# EAGLE design pich (EAGLE 6.5.0)
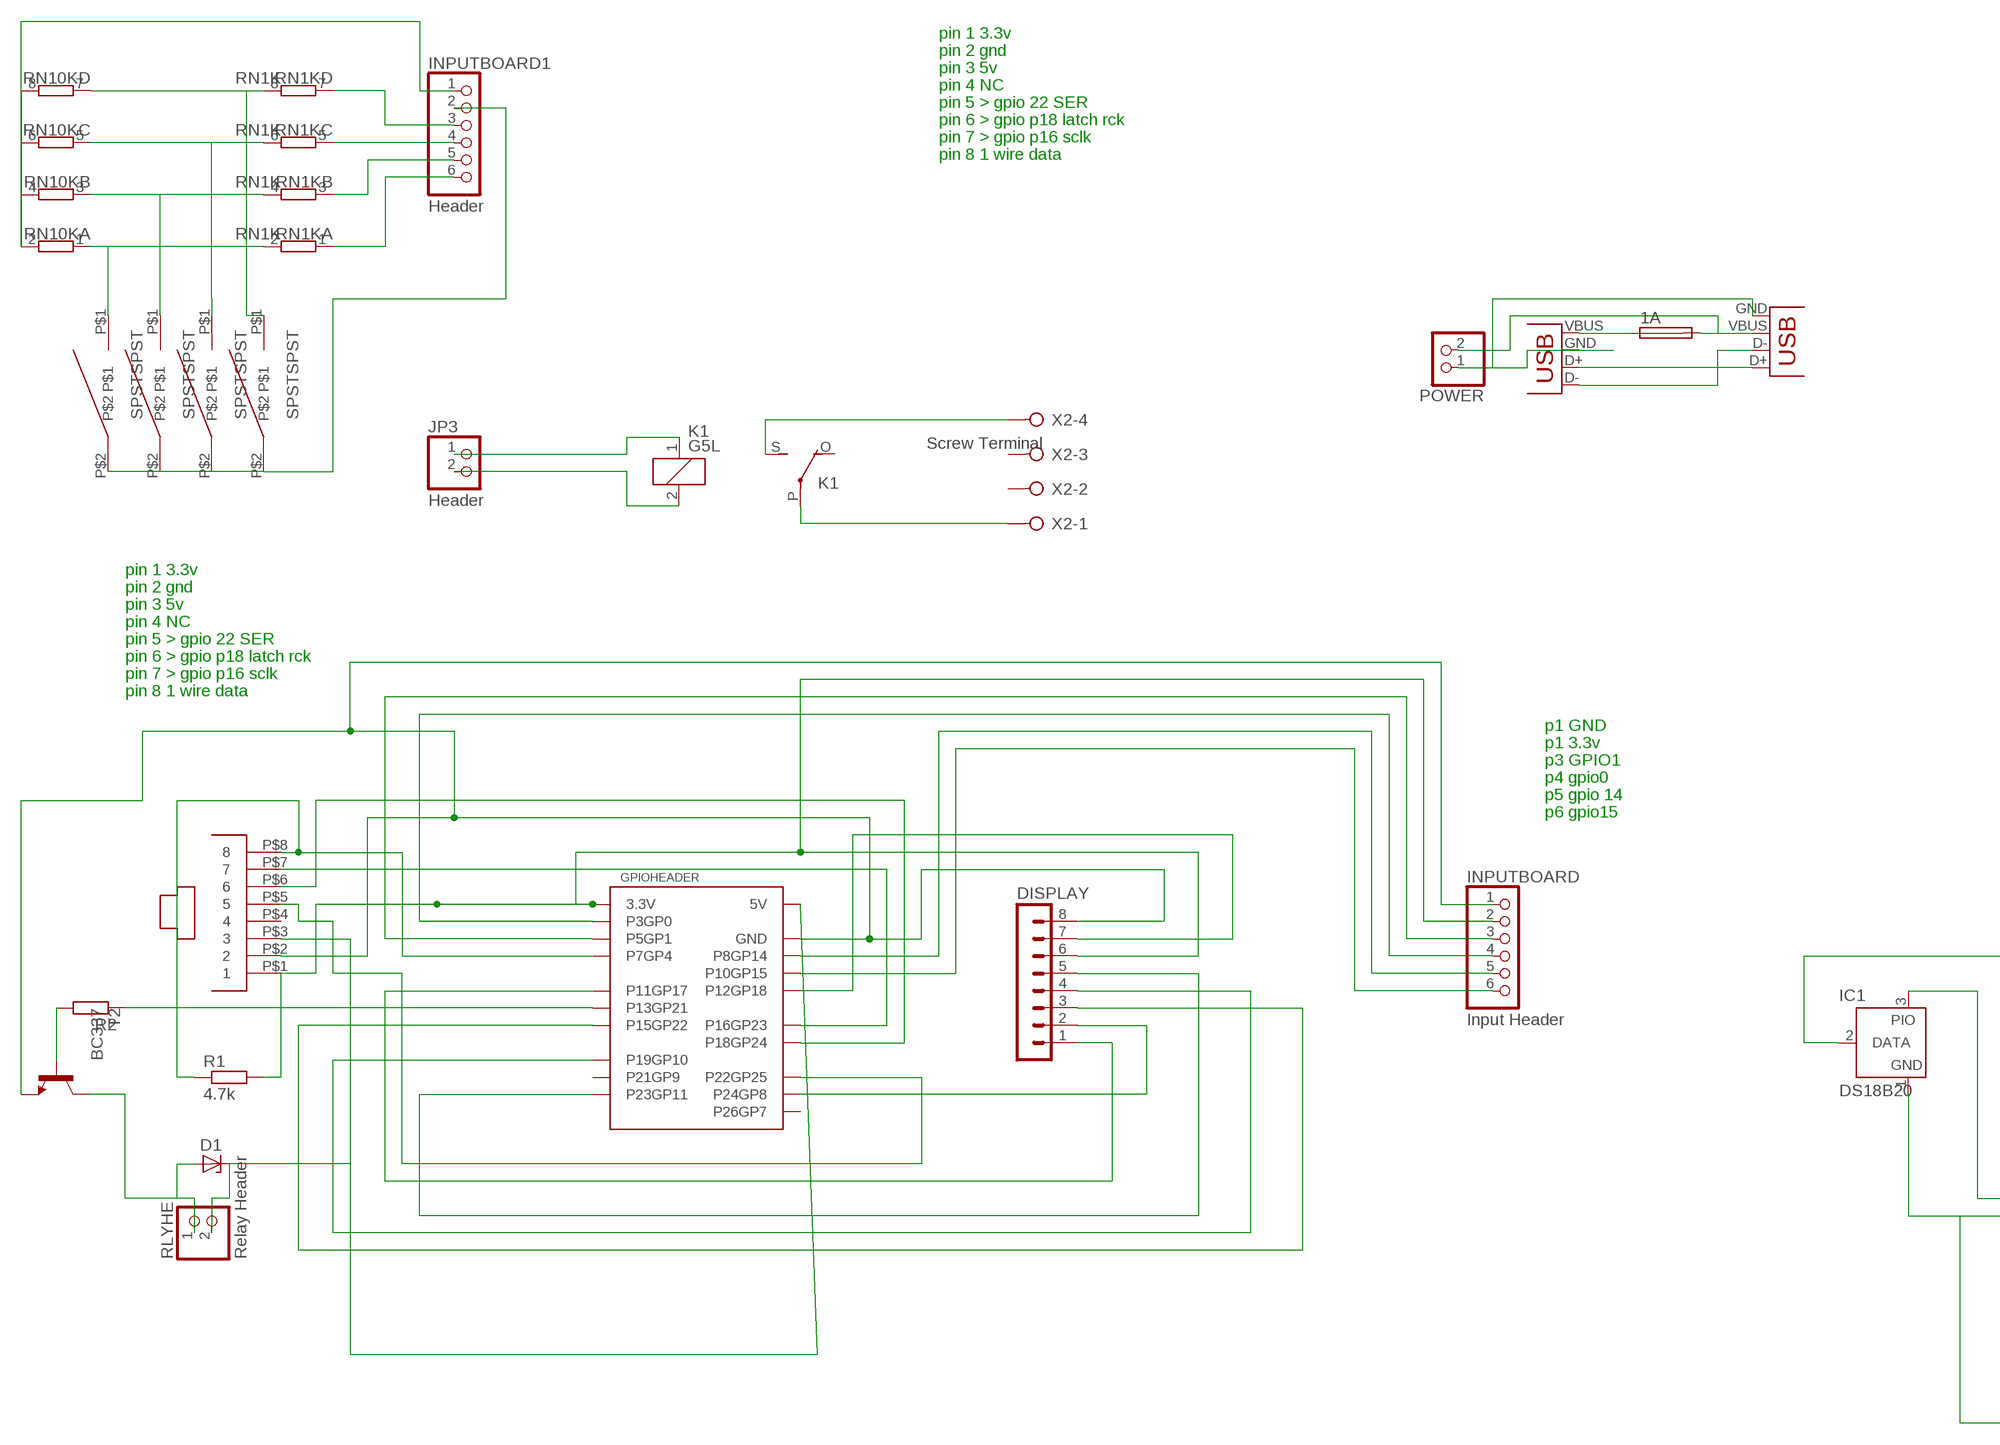
[diagram p0: schematic, sheet 1, part 1 of 2]
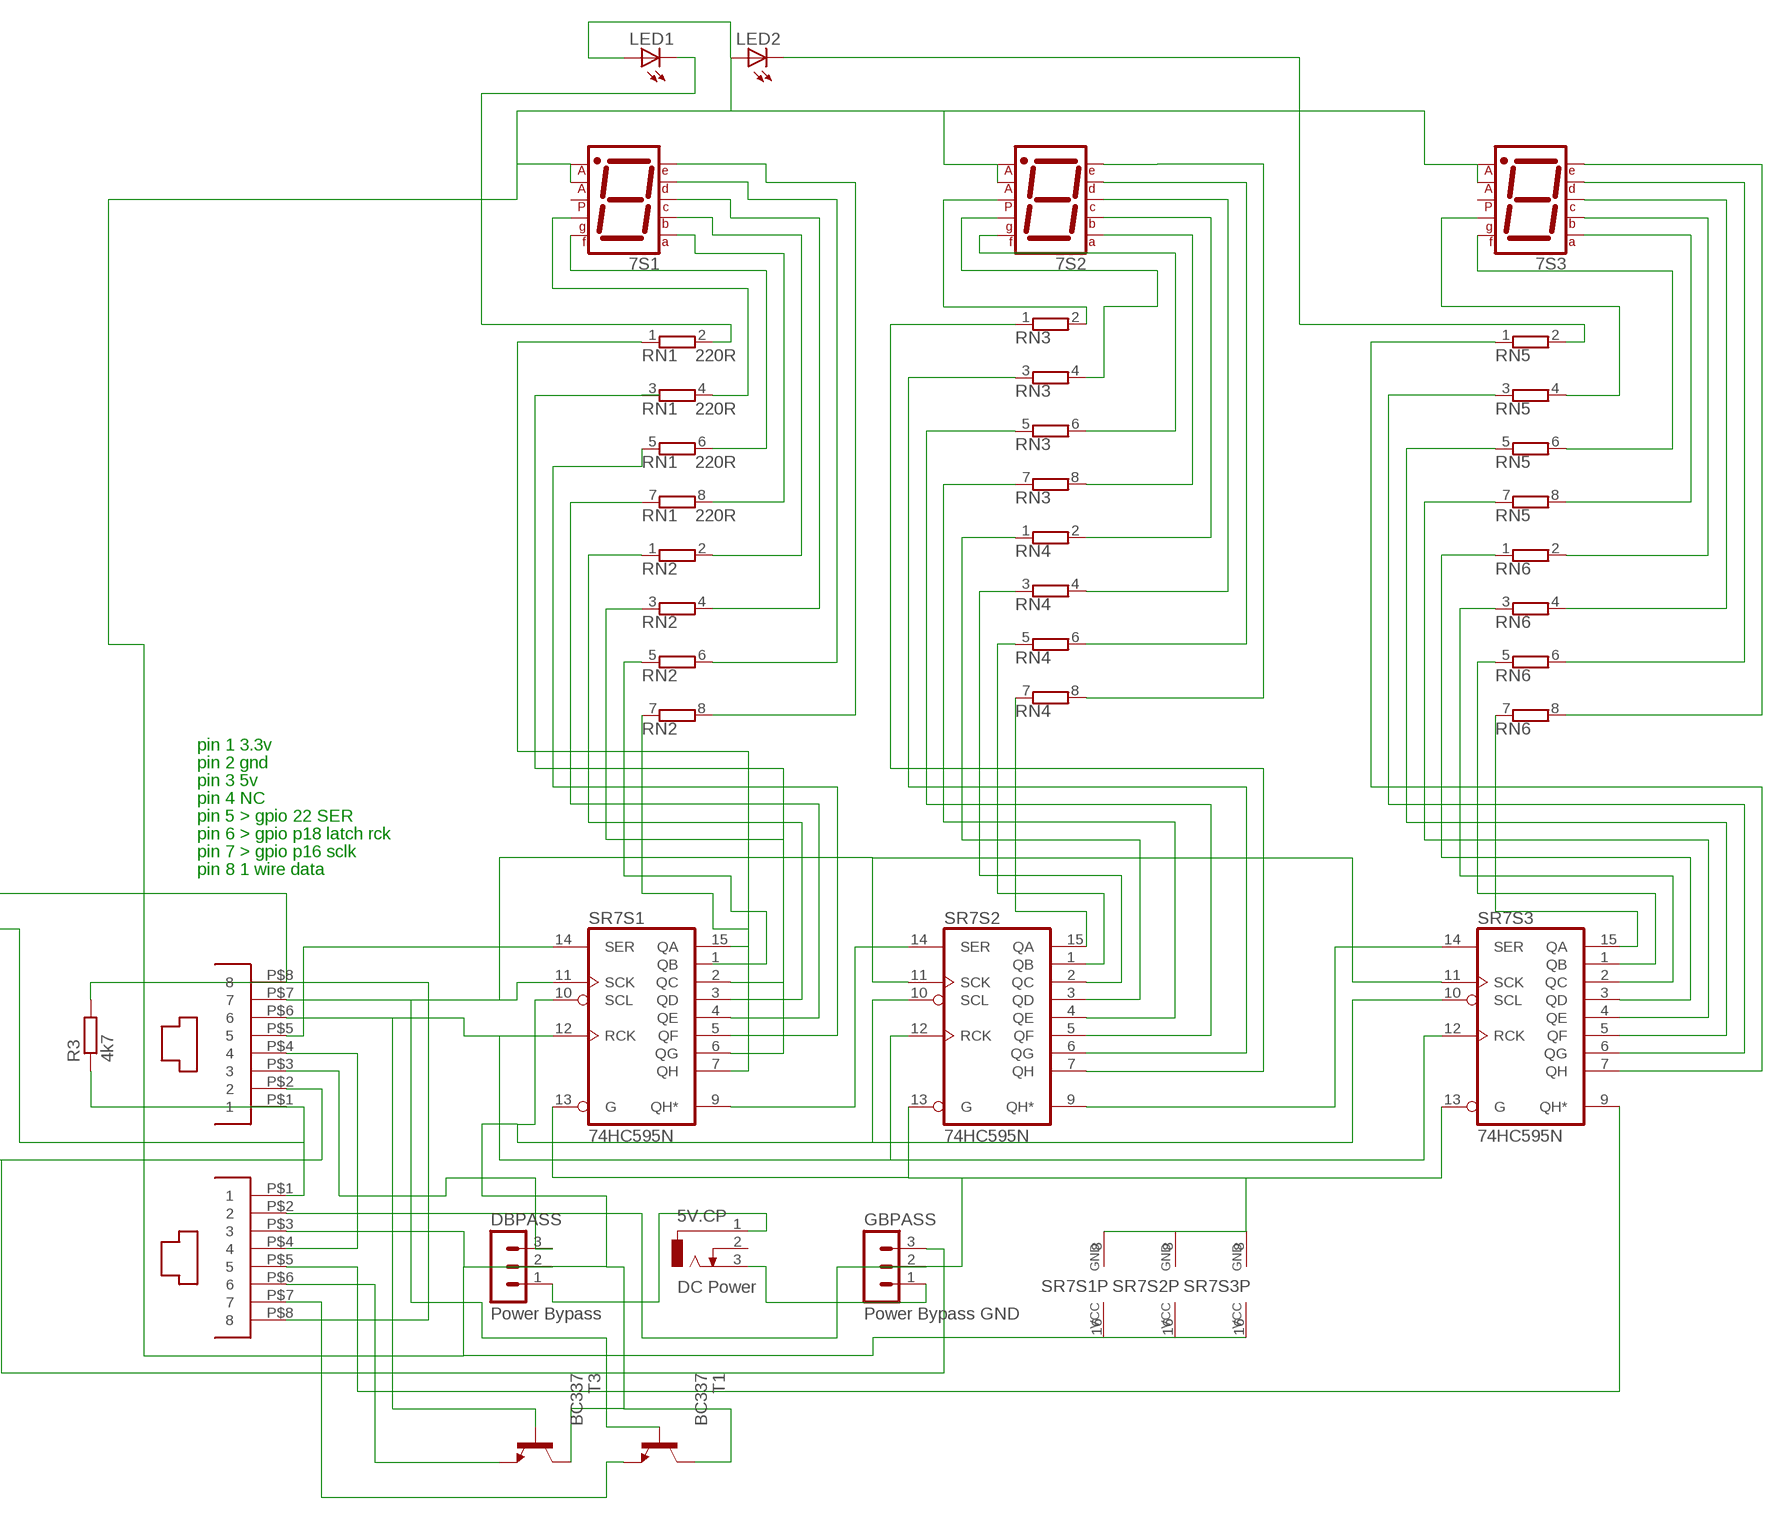
[diagram p1: schematic, sheet 1, part 2 of 2]

## Parts
1A  QPL  [QPL]
5V.CP  DC Power  DCJ0303  [DCJ0303]
7S1  7SEG-MCA  [7SEG-7]
7S2  7SEG-MCA  [7SEG-7]
7S3  7SEG-MCA  [7SEG-7]
.  USB-A-H  [USB-A-H]
D1  1N821  [DO35Z10]
DBPASS  Power Bypass  MA03-1  [MA03-1]
DISPLAY  MA08-1  [MA08-1]
GBPASS  Power Bypass GND  MA03-1  [MA03-1]
GPIOHEADER  GPIOGPIOHEADER  [FE13-2]
IC1  DS18B20  DS2405  [TO92-]
INPUTBOARD  Input Header  PINHD-1X6  [1X06]
INPUTBOARD1  Header  PINHD-1X6  [1X06]
INPUTHEADER  ETHERNETTRUCONNECTRAPID  [ETHERNET]
JP3  Header  PINHD-1X2  [1X02]
K1  G5L  [G5LE]
LED1  LED3MM  [LED3MM]
LED2  LED3MM  [LED3MM]
OUTPUTHEADER  ETHERNETTRUCONNECTRAPID  [ETHERNET]
POWER  PINHD-1X2  [1X02]
R1  4.7k  R-EU_0207/10  [0207/10]
R2  R-EU_0204/7  [0204/7]
R3  4k7  R-EU_0204/2V  [0204V]
RLYHE  Relay Header  PINHD-1X2  [1X02]
RN1  220R  E4RP  [SIL8]
RN1K  RN1K  E4R  [SIL8]
RN2  E4RP  [SIL8]
RN3  E4RP  [SIL8]
RN4  E4RP  [SIL8]
RN5  E4RP  [SIL8]
RN6  E4RP  [SIL8]
RN10K  E4R  [SIL8]
SR7S1  74HC595N  [DIL16]
SR7S2  74HC595N  [DIL16]
SR7S3  74HC595N  [DIL16]
T1  BC337  [TO92]
T2  BC337  [TO92]
T3  BC337  [TO92]
THERMHEADER  ETHERNETTRUCONNECTRAPID  [ETHERNET]
U$2  SPSTSPST  [MAPLINSWITCH]
U$3  SPSTSPST  [MAPLINSWITCH]
U$4  SPSTSPST  [MAPLINSWITCH]
U$5  SPSTSPST  [MAPLINSWITCH]
X1  USB-A-HU  [USB-A-HU]
X2  Screw Terminal  W237-04P  [W237-4P]

## Nets
GND: DISPLAY.8 GPIOHEADER.6(GND) GPIOHEADER.9(GND) GPIOHEADER.14(GND) GPIOHEADER.20(GND) GPIOHEADER.25(GND) INPUTBOARD.1 T2.1(E) THERMHEADER.P$2
GND1: ..GND(VBUS) POWER.1 X1.GND
GPIO4W1DATA: GPIOHEADER.7(P7GP4) R1.1 THERMHEADER.P$8
N$1: 1A.2 POWER.2 X1.VBUS
N$2: D1.C GPIOHEADER.2(5V) GPIOHEADER.4(5V) RLYHE.2 THERMHEADER.P$3
N$3: DISPLAY.7 GPIOHEADER.12(P12GP18)
N$4: DISPLAY.1 GPIOHEADER.11(P11GP17)
N$5: DISPLAY.5 GPIOHEADER.23(P23GP11)
N$6: DISPLAY.4 GPIOHEADER.19(P19GP10)
N$7: DISPLAY.3 GPIOHEADER.15(P15GP22)
N$8: DISPLAY.2 GPIOHEADER.24(P24GP8)
N$9: GPIOHEADER.16(P16GP23) THERMHEADER.P$7
N$10: GPIOHEADER.18(P18GP24) THERMHEADER.P$6
N$11: GPIOHEADER.22(P22GP25) THERMHEADER.P$5
N$12: D1.A RLYHE.1 T2.3(C)
N$13: GPIOHEADER.13(P13GP21) R2.1
N$14: R2.2 T2.2(B)
N$15: JP3.1 K1.1
N$16: JP3.2 K1.2
N$17: GPIOHEADER.3(P3GP0) INPUTBOARD.4
N$18: GPIOHEADER.8(P8GP14) INPUTBOARD.5
N$19: GPIOHEADER.5(P5GP1) INPUTBOARD.3
N$20: GPIOHEADER.10(P10GP15) INPUTBOARD.6
N$21: K1.P(2:P) X2.1
N$22: K1.S(2:S) X2.4
N$23: SR7S1.9(QH*) SR7S2.14(SER)
N$24: IC1.3(PIO) INPUTHEADER.P$1 OUTPUTHEADER.P$1 R3.1
N$25: GBPASS.2 OUTPUTHEADER.P$2 SR7S1.8(GND) SR7S1.13(G) SR7S2.8(GND) SR7S2.13(G) SR7S3.8(GND) SR7S3.13(G)
N$26: INPUTHEADER.P$4 OUTPUTHEADER.P$4
N$27: INPUTHEADER.P$5 SR7S1.14(SER)
N$28: INPUTHEADER.P$6 SR7S1.12(RCK) SR7S2.12(RCK) SR7S3.12(RCK) T3.2(B)
N$30: IC1.2(DATA) INPUTHEADER.P$8 OUTPUTHEADER.P$8 R3.2
N$31: SR7S2.9(QH*) SR7S3.14(SER)
N$32: LED1.K(C) RN1.2
N$33: 7S1.3(G) RN1.4
N$34: 7S1.2(F) RN1.6
N$35: 7S1.10(A) RN1.8
N$36: 7S1.9(B) RN2.2
N$37: 7S1.8(C) RN2.4
N$38: 7S1.5(D) RN2.6
N$39: 7S1.4(E) RN2.8
N$40: RN2.7 SR7S1.15(QA)
N$41: RN2.5 SR7S1.1(QB)
N$42: RN2.3 SR7S1.2(QC)
N$43: RN2.1 SR7S1.3(QD)
N$44: RN1.7 SR7S1.4(QE)
N$45: RN1.5 SR7S1.5(QF)
N$46: RN1.3 SR7S1.6(QG)
N$47: RN1.1 SR7S1.7(QH)
N$48: GBPASS.3 IC1.1(GND) INPUTHEADER.P$2
N$49: 7S2.7(DP) RN3.2
N$50: 7S2.3(G) RN3.4
N$51: 7S2.2(F) RN3.6
N$52: 7S2.10(A) RN3.8
N$53: 7S2.9(B) RN4.2
N$54: 7S2.8(C) RN4.4
N$55: 7S2.5(D) RN4.6
N$56: 7S2.4(E) RN4.8
N$57: RN4.7 SR7S2.15(QA)
N$58: RN4.5 SR7S2.1(QB)
N$59: RN4.1 SR7S2.3(QD)
N$60: RN3.7 SR7S2.4(QE)
N$61: RN3.3 SR7S2.6(QG)
N$62: RN3.1 SR7S2.7(QH)
N$63: LED2.K(C) RN5.2
N$64: 7S3.3(G) RN5.4
N$65: 7S3.2(F) RN5.6
N$66: 7S3.10(A) RN5.8
N$67: 7S3.9(B) RN6.2
N$68: 7S3.8(C) RN6.4
N$69: 7S3.5(D) RN6.6
N$70: 7S3.4(E) RN6.8
N$71: RN6.7 SR7S3.15(QA)
N$72: RN6.5 SR7S3.1(QB)
N$73: RN6.3 SR7S3.2(QC)
N$74: RN6.1 SR7S3.3(QD)
N$75: RN5.7 SR7S3.4(QE)
N$76: RN5.5 SR7S3.5(QF)
N$77: RN5.3 SR7S3.6(QG)
N$78: RN5.1 SR7S3.7(QH)
N$79: DBPASS.3 INPUTHEADER.P$3
N$80: RN4.3 SR7S2.2(QC)
N$81: RN3.5 SR7S2.5(QF)
N$82: 5V.CP.1 DBPASS.1
N$83: 5V.CP.3 GBPASS.1
N$84: 7S1.1(CA1) 7S1.6(CA2) 7S2.1(CA1) 7S2.6(CA2) 7S3.1(CA1) 7S3.6(CA2) DBPASS.2 LED1.A LED2.A OUTPUTHEADER.P$3 SR7S1.10(SCL) SR7S1.16(VCC) SR7S2.10(SCL) SR7S2.16(VCC) SR7S3.10(SCL) SR7S3.16(VCC) T1.3(C) T3.3(C)
N$85: OUTPUTHEADER.P$5 SR7S3.9(QH*)
N$86: 1A.1 ..VBUS(GND)
N$87: ..D-(D+) X1.D-
N$88: ..D+(D-) X1.D+
N$93: OUTPUTHEADER.P$7 T1.1(E)
N$94: RN1K.8 RN10K.7 U$5.P$1
N$95: INPUTBOARD1.1 RN10K.2 RN10K.4 RN10K.6 RN10K.8
N$96: INPUTBOARD1.3 RN1K.7
N$97: INPUTBOARD1.4 RN1K.5
N$98: INPUTBOARD1.5 RN1K.3
N$99: INPUTBOARD1.6 RN1K.1
N$100: INPUTBOARD1.2 U$2.P$2 U$3.P$2 U$4.P$2 U$5.P$2
N$101: RN1K.6 RN10K.5 U$4.P$1
N$102: RN1K.4 RN10K.3 U$3.P$1
N$103: RN1K.2 RN10K.1 U$2.P$1
N$104: INPUTHEADER.P$7 SR7S1.11(SCK) SR7S2.11(SCK) SR7S3.11(SCK) T1.2(B)
N$107: OUTPUTHEADER.P$6 T3.1(E)
VCC: DISPLAY.6 GPIOHEADER.1(3.3V) GPIOHEADER.17(3.3V) INPUTBOARD.2 R1.2 THERMHEADER.P$1
Unconnected: 5V.CP.2 7S1.7(DP) 7S3.7(DP) GPIOHEADER.21(P21GP9) GPIOHEADER.26(P26GP7) K1.O(2:O) THERMHEADER.P$4 X2.2 X2.3

## Notes on the sheet
- pin 1 3.3v
- pin 2 gnd
- pin 3 5v
- pin 4 NC
- pin 5 > gpio 22 SER
- pin 6 > gpio p18 latch rck
- pin 7 > gpio p16 sclk
- pin 8 1 wire data
- pin 1 3.3v
- pin 2 gnd
- pin 3 5v
- pin 4 NC
- pin 5 > gpio 22 SER
- pin 6 > gpio p18 latch rck
- pin 7 > gpio p16 sclk
- pin 8 1 wire data
- p1 GND
- p1 3.3v
- p3 GPIO1
- p4 gpio0
- p5 gpio 14
- p6 gpio15 | pin 1 3.3v
- pin 2 gnd
- pin 3 5v
- pin 4 NC
- pin 5 > gpio 22 SER
- pin 6 > gpio p18 latch rck
- pin 7 > gpio p16 sclk
- pin 8 1 wire data

## Library data of the parts
1A = fuse:QPL: Fuseholder for Micro(TM) Fuse or Pico(R) II Fuses 281 005, 281 008 Source:www.littlefuse.com .. 281005A.PDF; OC_FARNELL: 1608231; OC_NEWARK: unknown
5V.CP = con-jack:DCJ0303: DC POWER JACK Source: DCJ0303.pdf; OC_FARNELL: unknown; OC_NEWARK: unknown
7S1-7S3 = special:7SEG-MCA: 7-segment DISPLAY single anode, 13 mm
. = SparkFun-Connectors:USB: USB Connectors USB-B-PTH is fully proven SKU : PRT-00139/CONN-08278 USB-miniB is fully proven SKU : PRT-00587 USB-A-PCB is untested. USB-A-H is throughly reviewed, but untested. Spark Fun Electronics SKU : PRT-00437 USB-B-SMT is throughly reviewed, but untested. Needs silkscreen touching up. USB-A-S has not been used/tested USB-MB-H has not been used/tested USB-MICROB has been used. CONN-09505
D1 = diode:1N821: Reference DIODE temperature compensated, 6,2 V
DBPASS GBPASS = con-lstb:MA03-1: PIN HEADER; OC_FARNELL: unknown; OC_NEWARK: unknown
DISPLAY = con-lstb:MA08-1: PIN HEADER; OC_FARNELL: unknown; OC_NEWARK: unknown
GPIOHEADER = con-lsta:GPIO
IC1 = maxim:DS2405: Addressable Switch DALLAS Semiconductor; MF: DALLAS SEMICONDUCTOR; MPN: DS2405; OC_FARNELL: 1188025; OC_NEWARK: 06F4645
INPUTBOARD INPUTBOARD1 = pinhead:PINHD-1X6: PIN HEADER
INPUTHEADER OUTPUTHEADER THERMHEADER = rpigpio:ETHERNET: http://www.rapidonline.com/pdf/24-0450.pdf http://www.rapidonline.com/Cables-Connectors/8-8-PCB-Socket-24-0465
JP3 POWER RLYHE = pinhead:PINHD-1X2: PIN HEADER
K1 = relay:G5L: RELAY 1 x switch, 10 A/120 V AC, 8 A/30 V ADC, Omron; OC_FARNELL: unknown; OC_NEWARK: unknown
LED1 LED2 = led:LED: LED OSRAM: - CHIPLED LG R971, LG N971, LY N971, LG Q971, LY Q971, LO R971, LY R971 LH N974, LH R974 LS Q976, LO Q976, LY Q976 LO Q996 - Hyper CHIPLED LW Q18S LB Q993, LB Q99A, LB R99A - SideLED LS A670, LO A670, LY A670, LG A670, LP A670 LB A673, LV A673, LT A673, LW A673 LH A674 LY A675 LS A676, LA A676, LO A676, LY A676, LW A676 LS A679, LY A679, LG A679 - Hyper Micro SIDELED® LS Y876, LA Y876, LO Y876, LY Y876 LT Y87S - SmartLED LW L88C, LW L88S LB L89C, LB L89S, LG L890 LS L89K, LO L89K, LY L89K LS L896, LA L896, LO L896, LY L896 - TOPLED LS T670, LO T670, LY T670, LG T670, LP T670 LSG T670, LSP T670, LSY T670, LOP T670, LYG T670 LG T671, LOG T671, LSG T671 LB T673, LV T673, LT T673, LW T673 LH T674 LS T676, LA T676, LO T676, LY T676, LB T676, LH T676, LSB T676, LW T676 LB T67C, LV T67C, LT T67C, LS T67K, LO T67K, LY T67K, LW E67C LS E67B, LA E67B, LO E67B, LY E67B, LB E67C, LV E67C, LT E67C LW T67C LS T679, LY T679, LG T679 LS T770, LO T770, LY T770, LG T770, LP T770 LB T773, LV T773, LT T773, LW T773 LH T774 LS E675, LA E675, LY E675, LS T675 LS T776, LA T776, LO T776, LY T776, LB T776 LHGB T686 LT T68C, LB T68C - Hyper Mini TOPLED® LB M676 - Mini TOPLED Santana® LG M470 LS M47K, LO M47K, LY M47K Source: http://www.osram.convergy.de LUXEON: - LUMILED® LXK2-PW12-R00, LXK2-PW12-S00, LXK2-PW14-U00, LXK2-PW14-V00 LXK2-PM12-R00, LXK2-PM12-S00, LXK2-PM14-U00 LXK2-PE12-Q00, LXK2-PE12-R00, LXK2-PE12-S00, LXK2-PE14-T00, LXK2-PE14-U00 LXK2-PB12-K00, LXK2-PB12-L00, LXK2-PB12-M00, LXK2-PB14-N00, LXK2-PB14-P00, LXK2-PB14-Q00 LXK2-PR12-L00, LXK2-PR12-M00, LXK2-PR14-Q00, LXK2-PR14-R00 LXK2-PD12-Q00, LXK2-PD12-R00, LXK2-PD12-S00 LXK2-PH12-R00, LXK2-PH12-S00 LXK2-PL12-P00, LXK2-PL12-Q00, LXK2-PL12-R00 Source: www.luxeon.com KINGBRIGHT: KA-3528ASYC Source: www.kingbright.com
R1-R3 = resistor:R-EU_: RESISTOR, European symbol
RN1-RN6 = resistor-sil:E4RP: SIL RESISTOR; OC_FARNELL: unknown; OC_NEWARK: unknown
RN1K RN10K = resistor-sil:E4R: SIL RESISTOR; OC_FARNELL: unknown; OC_NEWARK: unknown
SR7S1-SR7S3 = 74xx-eu:74*595: 8-bit SHIFT REGISTER, output latch
T1 T3 = transistor:BC337: NPN TRANSISTOR
T2 = transistor-npn:BC337*: NPN Transistor
U$2-U$5 = rpigpio:SPST
X1 = con-usb:USB: USB Connectors USB-B-PTH is fully proven SKU : PRT-00139/CONN-08278 USB-miniB is fully proven SKU : PRT-00587 USB-A-PCB is untested. USB-A-H is throughly reviewed, but untested. Spark Fun Electronics SKU : PRT-00437 USB-B-SMT is throughly reviewed, but untested. Needs silkscreen touching up. USB-A-S has not been used/tested USB-MB-H has not been used/tested USB-MICROB has been used. CONN-09505
X2 = con-wago-508:W237-04P: WAGO SREW CLAMP; OC_FARNELL: unknown; OC_NEWARK: unknown

## Board
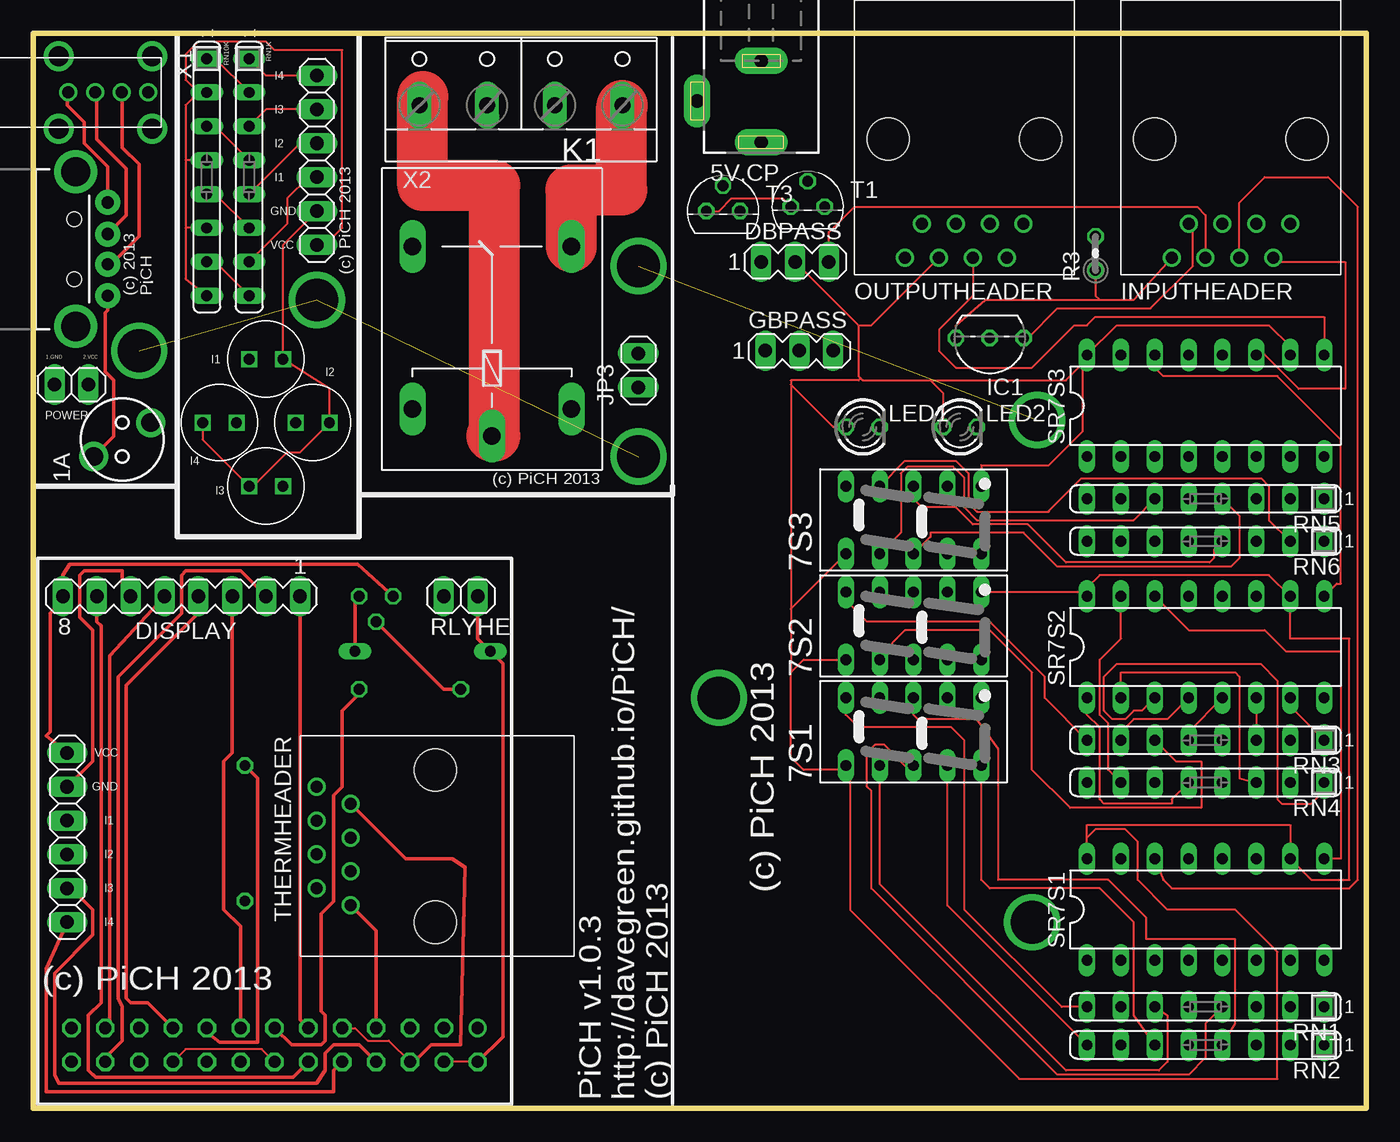
[diagram p2: board, top side]
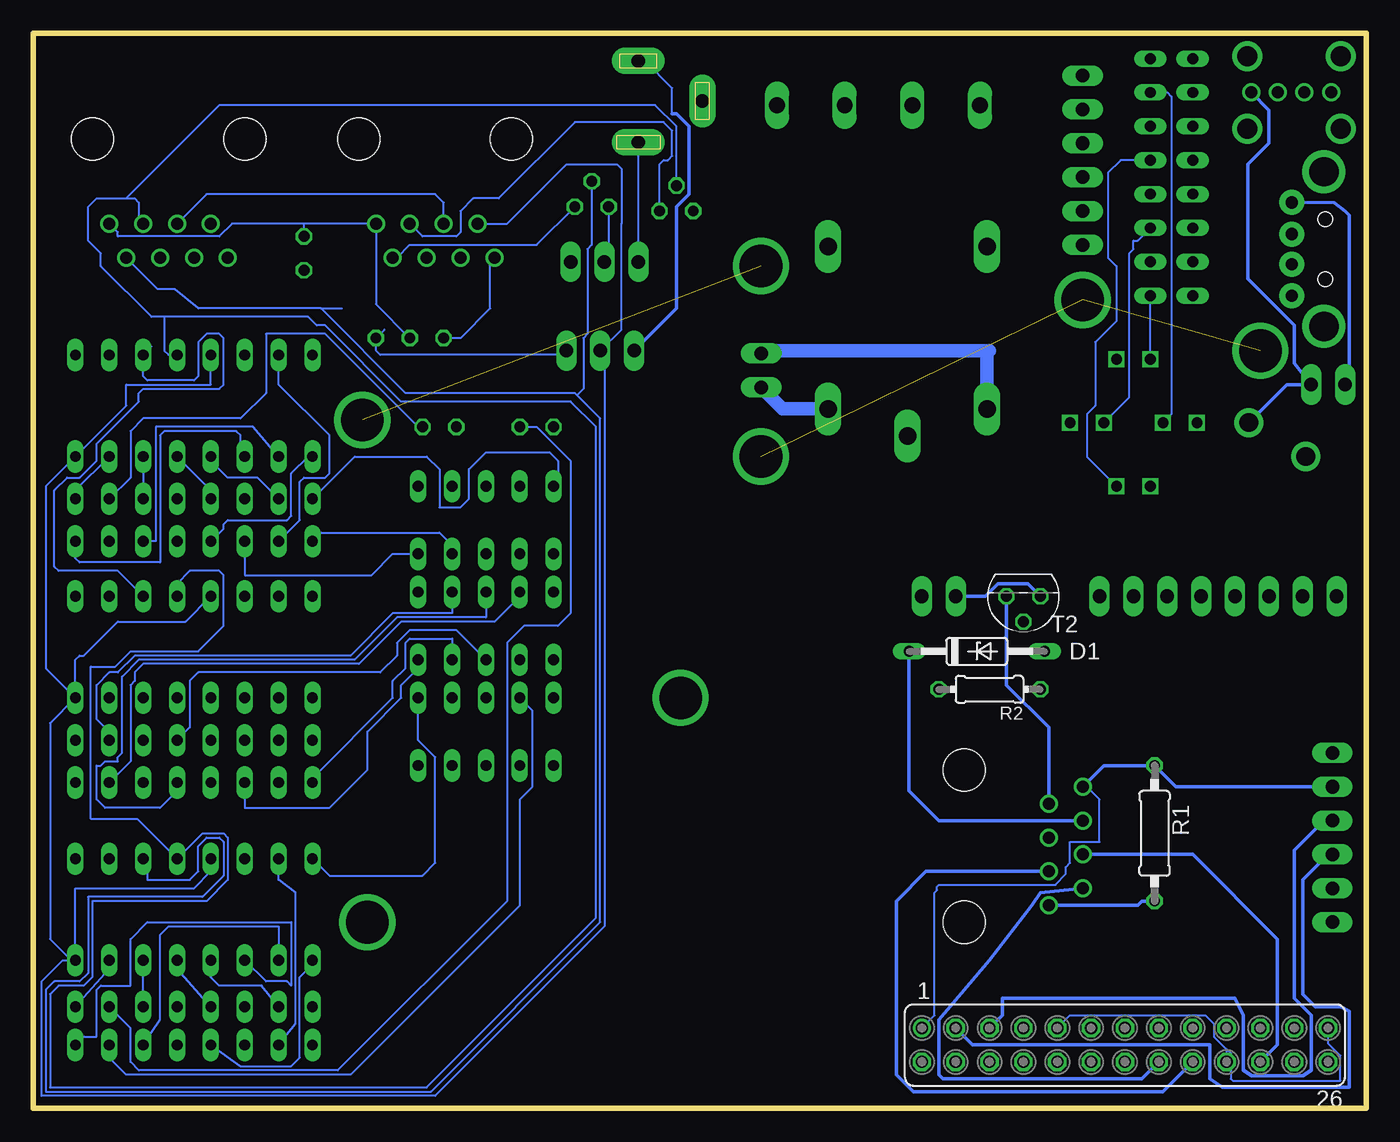
[diagram p3: board, bottom side, seen from below]

Size 100 x 80.64 mm. Coordinates in mm from the lower left corner, seen from the top.
Outline: 0,0 100,0 100,80.64 0,80.64 0,0
Copper layers (1*2*15*16): Top 0.035mm / dielectric 0.2mm / layer 2 0.0175mm / dielectric 1.1mm / layer 15 0.0175mm / dielectric 0.2mm / Bottom 0.035mm
Design rules "default": minimum track width 6mil, minimum drill 12mil, track to track 6mil, track to pad 6mil, pad to pad 6mil, via to via 6mil, smd to smd 0mil, copper to edge 10mil, drill to drill 10mil, minimum pad ring 6mil, minimum via ring 6mil, stop-mask expansion 2mil, vias tented up to drill 25mil, thermal gap 10mil

### Footprints (pad centres in the part's own frame; a part is rotated, then mirrored left to right if it is on the bottom)
QPL = drill 1.4 pad 2.184: 1 -1.27,2.139; 2 1.27,-2.139
DCJ0303 = drill 1 pad 2 long: 1 0,3.1; 2 4.8,0; 3 0,-3
7SEG-7 = drill 0.813 long: 1 -2.54,5.08; 2 -2.54,2.54; 3 -2.54,0; 4 -2.54,-2.54; 5 -2.54,-5.08; 6 2.54,-5.08; 7 2.54,-2.54; 8 2.54,0; 9 2.54,2.54; 10 2.54,5.08
USB-A-H = drill 0.914 pad 1.88: D+ 2.4,1.127; D- 2.4,-1.127; GND 2.4,3.5; VBUS 2.4,-3.5 | drill 2.2: GND2 0,-5.8; GND3 0,5.8 | hole 1.1: -0.1,2.25; -0.1,-2.25
DO35Z10 = drill 0.813 long: A 5.08,0; C -5.08,0
MA03-1 = drill 1.016 long: 1 -2.54,0; 2 0,0; 3 2.54,0
MA08-1 = drill 1.016 long: 1 -8.89,0; 2 -6.35,0; 3 -3.81,0; 4 -1.27,0; 5 1.27,0; 6 3.81,0; 7 6.35,0; 8 8.89,0
FE13-2 = drill 0.914: 1 -15.24,1.27 | drill 0.914 octagon: 2 -15.24,-1.27; 3 -12.7,1.27; 4 -12.7,-1.27; 5 -10.16,1.27; 6 -10.16,-1.27; 7 -7.62,1.27; 8 -7.62,-1.27; 9 -5.08,1.27; 10 -5.08,-1.27; 11 -2.54,1.27; 12 -2.54,-1.27; 13 0,1.27; 14 0,-1.27; 15 2.54,1.27; 16 2.54,-1.27; 17 5.08,1.27; 18 5.08,-1.27; 19 7.62,1.27; 20 7.62,-1.27; 21 10.16,1.27; 22 10.16,-1.27; 23 12.7,1.27; 24 12.7,-1.27; 25 15.24,1.27; 26 15.24,-1.27
TO92- = drill 0.813 octagon: 1 -2.54,0; 2 0,0; 3 2.54,0
1X06 = drill 1.016 long: 1 -6.35,0; 2 -3.81,0; 3 -1.27,0; 4 1.27,0; 5 3.81,0; 6 6.35,0
ETHERNET = drill 0.9: P$1 3.81,1.27; P$2 5.08,3.81; P$3 6.35,1.27; P$4 7.62,3.81; P$5 8.89,1.27; P$6 10.16,3.81; P$7 11.43,1.27; P$8 12.7,3.81 | hole 3.17: 2.54,10.16; 13.97,10.16
1X02 = drill 1.016 long: 1 -1.27,0; 2 1.27,0
G5LE = drill 1.321 long: 1 -7.493,-5.969; 2 -7.493,5.969; O 4.699,5.969; P -9.525,0; S 4.699,-5.969
LED3MM = drill 0.813 octagon: A -1.27,0; K 1.27,0
0207/10 = drill 0.813 octagon: 1 -5.08,0; 2 5.08,0
0204/7 = drill 0.813 octagon: 1 -3.81,0; 2 3.81,0
0204V = drill 0.813 octagon: 1 -1.27,0; 2 1.27,0
SIL8 = drill 0.813 long: 1 -8.89,0; 2 -6.35,0; 3 -3.81,0; 4 -1.27,0; 5 1.27,0; 6 3.81,0; 7 6.35,0; 8 8.89,0
DIL16 = drill 0.813 long: 1 -8.89,-3.81; 2 -6.35,-3.81; 3 -3.81,-3.81; 4 -1.27,-3.81; 5 1.27,-3.81; 6 3.81,-3.81; 7 6.35,-3.81; 8 8.89,-3.81; 9 8.89,3.81; 10 6.35,3.81; 11 3.81,3.81; 12 1.27,3.81; 13 -1.27,3.81; 14 -3.81,3.81; 15 -6.35,3.81; 16 -8.89,3.81
TO92 = drill 0.813 octagon: 1 1.27,0; 2 0,1.905; 3 -1.27,0
MAPLINSWITCH = drill 0.8 square: P$1 -1.27,0; P$2 1.27,0
USB-A-HU = drill 0.9: D+ 2.73,0; D- 4.73,0; GND 0.73,0; VBUS 6.73,0 | drill 1.5: P$5 0,2.72; P$6 0,-2.72; P$7 7,2.72; P$8 7,-2.72
W237-4P = drill 1.194 long: 1 -7.62,-0.635; 2 -2.54,-0.635; 3 2.54,-0.635; 4 7.62,-0.635

### Placement (x,y rotation side)
1A  6.67,50.16 90 top
5V.CP  54.61,75.57 180 top
7S1  66.04,28.26 90 top
7S2  66.04,36.2 90 top
7S3  66.04,44.13 90 top
.  3.17,64.45 0 top
D1  29.21,34.29 0 bottom
DBPASS  57.15,63.5 0 top
DISPLAY  11.11,38.42 180 top
GBPASS  57.47,56.83 0 top
GPIOHEADER  18.1,4.76 0 bottom
IC1  71.75,57.78 180 top
INPUTBOARD  2.54,20.32 270 top
INPUTBOARD1  21.27,71.12 90 top
INPUTHEADER  81.6,62.55 0 top
JP3  45.4,55.36 90 top
K1  34.41,59.96 90 top
LED1  62.23,51.12 0 top
LED2  69.53,51.12 0 top
OUTPUTHEADER  61.59,62.55 0 top
POWER  2.86,54.29 0 top
R1  15.88,20.64 90 bottom
R2  28.26,31.43 180 bottom
R3  79.69,64.14 90 top
RLYHE  32.07,38.42 0 top
RN1  87.95,7.62 180 top
RN1K  16.19,69.85 270 top
RN2  87.95,4.76 180 top
RN3  87.95,27.62 180 top
RN4  87.95,24.45 180 top
RN5  87.95,45.72 180 top
RN6  87.95,42.54 180 top
RN10K  13.02,69.85 270 top
SR7S1  87.95,14.92 0 top
SR7S2  87.95,34.61 0 top
SR7S3  87.95,52.7 0 top
T1  58.1,67.63 0 top
T2  25.72,38.42 180 bottom
T3  51.75,67.31 0 top
THERMHEADER  20,27.94 270 top
U$2  13.97,51.43 180 top
U$3  17.46,46.67 180 top
U$4  20.95,51.43 0 top
U$5  17.46,56.2 0 top
X1  1.91,76.2 0 top
X2  36.59,75.87 0 top

### Tracks (layer width: path | path; a pad name or v marks a point on that pad's centre or on a via)
GND
  Top 0.152: GPIOHEADER.9 24.13,6.03 25.08,5.08 26.67,5.08 GPIOHEADER.6 | GPIOHEADER.14 17.14,4.45 11.43,4.45 GPIOHEADER.20
  Top 0.254: INPUTBOARD.1 0.95,27.94 1.27,28.26 1.27,37.15 2.22,38.1 DISPLAY.8 2.22,40 2.73,40.83 24.32,40.83 T2.1 | GPIOHEADER.6 28.57,3.49 29.84,4.76 32.07,4.76 32.38,18.1 31.43,18.73 27.94,18.73 THERMHEADER.P$2
  Bottom 0.152: GPIOHEADER.9 22.23,6.98 12.06,6.98 11.43,6.35 11.43,5.4 10.48,4.45 | 10.48,4.45 GPIOHEADER.20 | 10.48,4.45 10.16,4.13 10.16,2.22 10.02,2.08 1.94,2.08 1.94,3.96 2.86,4.87 GPIOHEADER.25
  Bottom 0.254: THERMHEADER.P$2 23.81,28.58 26.99,31.75 T2.1
GND1
  Top 0.254: ..GND 5.58,70.62 3.81,72.39 3.81,73.98 2.54,75.25 2.54,76.11 X1.GND
  Bottom 0.254: ..GND 2.39,67.95 1.59,67.31 1.27,66.99 1.27,54.61 POWER.1
GPIO4W1DATA
  Top 0.254: THERMHEADER.P$8 25.72,13.33 GPIOHEADER.7
  Bottom 0.254: R1.1 16.83,15.56 17.14,15.24 THERMHEADER.P$8
N$1
  Bottom 0.254: X1.VBUS 7.3,74.87 7.3,72.39 8.89,70.8 8.89,62.23 5.4,58.74 5.4,55.88 POWER.2 5.95,54.29 1A.2
N$2
  Top 0.152: GPIOHEADER.2 GPIOHEADER.4
  Top 0.254: RLYHE.2 33.34,35.24 D1.C 35.24,33.34 35.24,5.4 GPIOHEADER.2
  Bottom 0.254: D1.C 34.29,23.81 32.07,21.59 THERMHEADER.P$3
N$3
  Top 0.254: DISPLAY.7 4.76,36.51 5.08,36.2 5.08,7.94 4.13,6.98 4.13,2.86 4.45,2.54 4.49,2.54 4.69,2.33 19.48,2.33 GPIOHEADER.12
N$4
  Top 0.254: DISPLAY.1 20,6.67 GPIOHEADER.11
N$5
  Top 0.254: GPIOHEADER.23 5.71,6.03 5.71,33.97 DISPLAY.5
N$6
  Top 0.254: DISPLAY.4 12.38,37.15 6.99,31.75 6.99,8.26 7.3,7.94 8.57,7.94 GPIOHEADER.19
N$7
  Top 0.254: DISPLAY.3 14.92,26.67 14.29,26.04 14.29,14.92 15.56,13.65 GPIOHEADER.15
N$8
  Top 0.254: GPIOHEADER.24 5.4,3.81 6.67,5.08 6.67,7.62 6.35,8.26 6.35,32.38 11.11,37.15 11.11,40 11.43,40.32 15.56,40.32 DISPLAY.2
N$9
  Bottom 0.254: THERMHEADER.P$7 24.45,16.19 25.08,15.24 28.26,11.11 32.07,6.67 32.07,2.54 31.75,2.22 16.83,2.22 GPIOHEADER.16
N$10
  Bottom 0.254: THERMHEADER.P$6 33.02,17.78 35.24,15.56 35.24,2.54 33.97,1.27 15.24,1.27 GPIOHEADER.18
N$11
  Bottom 0.254: THERMHEADER.P$5 13.02,19.05 6.67,12.7 6.67,4.76 GPIOHEADER.22
N$12
  Top 0.254: T2.3 24.13,38.42 D1.A
  Bottom 0.254: RLYHE.1 28.57,38.42 27.62,39.37 25.4,39.37 T2.3
N$13
  Top 0.254: R2.1 24.45,31.12 23.18,29.85 23.18,24.13 22.54,23.5 22.54,15.56 21.59,14.61 21.59,7.3 21.91,6.98 21.91,5.08 21.59,4.76 19.37,4.76 GPIOHEADER.13
N$14
  Top 0.254: R2.2 30.8,31.43 T2.2
N$15
  Bottom 1.016: JP3.1 43.78,52.47 K1.1
N$16
  Bottom 1.016: JP3.2 45.19,56.83 28.26,56.83 28.44,56.65 K1.2
N$17
  Bottom 0.254: INPUTBOARD.4 2.86,19.05 4.76,17.15 4.76,8.57 3.81,7.62 1.91,7.62 1.27,7.3 1.27,1.59 10.79,1.59 11.75,2.22 11.75,4.76 29.53,4.76 GPIOHEADER.3
N$18
  Top 0.254: INPUTBOARD.5 2.86,16.51 4.45,14.92 4.45,13.02 1.59,10.16 1.59,2.54 1.91,1.91 21.27,1.91 21.91,2.86 21.91,4.13 22.54,4.76 24.45,4.76 GPIOHEADER.8
N$19
  Bottom 0.254: INPUTBOARD.3 3.17,21.59 5.4,19.37 5.4,8.26 4.13,6.98 4.13,2.86 4.76,2.47 8.57,2.47 9.21,2.86 9.21,6.98 9.84,8.26 27.3,8.26 27.3,6.98 GPIOHEADER.5
N$20
  Top 0.254: INPUTBOARD.6 0.95,10.48 0.95,1.27 22.54,1.27 22.54,2.86 GPIOHEADER.10
N$21
  Top 0.152: X2.1 28.97,75.64 29.21,75.88
  Top 3.81: K1.P 34.61,50.43 34.61,69.22 29.21,69.22 29.21,75.88
N$22
  Top 3.81: K1.S 40.38,68.84 40.32,68.9 44.13,68.9 44.13,75.16 X2.4
N$23
  Top 0.152: SR7S2.14 86.68,35.88 92.39,35.88 93.98,34.29 98.11,34.29 98.11,18.73 SR7S1.9
N$24
  Top 0.152: IC1.3 69.22,58.74 71.44,60.64 80.01,60.64 | 80.01,60.64 82.55,60.64 INPUTHEADER.P$1 | R3.1 79.69,60.96 80.01,60.64
  Bottom 0.152: IC1.3 67.94,57.78 65.72,60.01 65.72,63.5 OUTPUTHEADER.P$1
N$25
  Bottom 0.152: SR7S2.8 99.06,33.02 99.06,46.67 SR7S3.8 93.03,52.7 93.03,54.29 86.68,54.29 SR7S3.13 | SR7S2.8 98.74,28.89 98.74,12.7 97.16,11.11 SR7S1.8 | SR7S1.8 96.84,16.51 87.95,16.51 86.68,17.78 SR7S1.13 | SR7S1.8 97.79,11.11 99.38,9.53 99.38,0.95 69.85,0.95 57.15,13.65 57.15,56.52 GBPASS.2 55.88,58.42 55.88,64.14 55.88,66.36 55.88,70.48 56.2,70.8 60.01,70.8 64.45,66.36 OUTPUTHEADER.P$2 | SR7S2.8 96.84,33.66 96.52,33.97 96.2,33.97 93.66,36.51 88.58,36.51 SR7S2.13
N$26
  Bottom 0.152: OUTPUTHEADER.P$4 69.22,67.95 69.85,68.58 87,68.58 INPUTHEADER.P$4
N$27
  Top 0.152: 84.45,18.73 SR7S1.14 84.77,17.15 85.41,16.51 98.74,16.51 99.38,17.15 99.38,67.63 97.16,69.85 92.39,69.85 90.49,67.95 INPUTHEADER.P$5
N$28
  Bottom 0.152: 90.17,59.37 90.17,56.83 89.85,56.52 SR7S3.12 | 90.17,59.37 79.38,59.37 78.74,58.74 78.11,58.74 72.39,53.02 59.69,53.02 57.78,51.12 57.78,14.29 70.48,1.59 98.74,1.59 98.74,8.57 98.11,9.21 96.2,9.21 95.57,9.84 95.57,15.56 87,15.56 85.41,17.15 85.41,20.32 85.72,20.64 87.31,20.64 SR7S1.12 92.2,21.71 95.69,21.71 95.69,33.14 93.86,33.14 92.71,34.29 87.63,34.29 85.72,36.2 85.72,40 86.04,40.32 88.27,40.32 89.22,39.37 SR7S2.12 | 90.17,59.37 91.12,59.37 94.93,63.18 94.93,64.14 95.89,65.09 95.89,67.63 95.25,68.26 93.03,68.26 | 93.03,68.26 92.39,68.26 92.08,67.95 92.08,66.68 INPUTHEADER.P$6 | 93.03,68.26 86.04,75.25 63.82,75.25 63.18,75.25 53.34,75.25 51.75,73.66 T3.2
N$30
  Bottom 0.152: 79.69,66.36 OUTPUTHEADER.P$8 74.3,60.32 IC1.2 | 79.69,66.36 85.09,66.36 86.04,65.41 93.66,65.41 93.66,65.72 INPUTHEADER.P$8 | R3.2 79.69,66.36
N$31
  Top 0.152: SR7S2.9 97.79,39.37 98.11,39.37 98.11,50.16 93.34,54.93 84.77,54.93 84.14,55.56 SR7S3.14
N$32
  Bottom 0.152: LED1.K 62.23,51.12 59.69,48.58 59.69,37.15 60.64,36.2 63.18,36.2 64.45,34.92 64.45,15.56 77.15,2.86 92.08,2.86 92.71,3.49 92.71,6.03 RN1.2
N$33
  Top 0.152: RN1.4 87.95,6.35 87.95,3.81 86.68,2.54 76.83,2.54 62.87,16.51 62.87,23.81 62.55,24.13 62.55,26.67 63.18,27.31 63.82,27.31 65.41,25.72 7S1.3
N$34
  Top 0.152: RN1.6 85.09,6.98 85.09,3.49 84.45,2.86 77.47,2.86 63.5,16.83 7S1.2
N$35
  Top 0.152: 7S1.10 60.96,29.53 61.91,28.58 68.9,28.58 69.85,27.62 69.85,18.1 69.85,17.15 69.85,14.92 77.15,7.62 RN1.8
N$36
  Bottom 0.152: RN2.2 94.3,3.81 93.03,2.54 76.2,2.54 63.5,15.24 63.5,23.18 62.55,24.13 62.55,29.85 7S1.9
N$37
  Top 0.152: RN2.4 90.17,6.35 90.17,12.7 83.5,12.7 83.5,14.29 80.64,17.15 72.39,17.15 72.39,26.99 70.8,29.21 66.36,29.21 66.04,29.53 7S1.8
N$38
  Top 0.152: RN2.6 82.55,6.98 82.55,13.97 80.01,16.51 71.75,16.51 71.12,17.15 7S1.5
N$39
  Top 0.152: 7S1.4 68.58,15.24 RN2.8
N$40
  Bottom 0.152: RN2.7 80.33,6.35 80.33,16.19 81.6,17.15 SR7S1.15
N$41
  Bottom 0.152: RN2.5 84.45,3.17 80.64,3.17 80.01,3.81 80.01,9.84 79.06,10.79 SR7S1.1
N$42
  Bottom 0.152: RN2.3 90.49,6.67 90.49,13.02 89.85,13.65 81.6,13.65 SR7S1.2
N$43
  Bottom 0.152: RN2.1 96.2,5.4 95.25,5.4 95.25,8.89 94.93,9.21 92.71,9.21 92.71,12.7 91.44,13.97 80.64,13.97 80.64,9.21 80.96,9.53 82.55,9.53 SR7S1.3
N$44
  Bottom 0.152: RN1.7 82.87,9.21 86.04,9.21 86.68,9.84 SR7S1.4
N$45
  Bottom 0.152: RN1.5 89.22,10.48 SR7S1.5
N$46
  Bottom 0.152: RN1.3 SR7S1.6
N$47
  Bottom 0.152: RN1.1 94.3,10.48 SR7S1.7
N$48
  Top 0.152: IC1.1 74.61,57.78 76.83,60.01 83.82,60.01 87,63.18 87,66.04 INPUTHEADER.P$2
  Bottom 0.152: GBPASS.3 60.33,56.52 73.98,56.52 74.3,56.83 IC1.1 73.66,58.42
N$49
  Bottom 0.152: RN3.2 94.3,28.26 95.25,29.21 95.25,31.75 94.3,32.7 93.66,32.7 92.39,33.97 76.2,33.97 73.03,37.15 68.58,37.15 7S2.7
N$50
  Bottom 0.152: 7S2.3 68.26,35.88 71.75,35.88 72.71,34.92 72.71,33.97 73.98,32.7 87.63,32.7 88.27,32.07 88.27,28.58 RN3.4
N$51
  Top 0.152: RN3.6 85.72,26.04 87.63,26.04 87.63,22.54 77.79,22.54 74.93,25.4 74.93,32.7 71.75,35.88 65.41,35.88 63.5,33.97 7S2.2
N$52
  Top 0.152: RN3.8 75.88,30.8 75.88,32.38 71.75,36.51 62.55,36.51 60.96,38.1 7S2.10
N$53
  Bottom 0.152: 7S2.9 63.5,38.42 65.41,36.51 72.39,36.51 75.56,33.34 91.76,33.34 92.39,32.7 92.39,32.07 92.71,31.75 92.71,26.04 RN4.2
N$54
  Bottom 0.152: RN4.4 89.22,23.81 90.49,22.54 94.61,22.54 95.25,23.18 95.25,25.72 94.93,25.72 94.61,26.04 93.66,26.04 93.66,26.35 93.34,26.67 93.34,32.38 92.08,33.66 75.88,33.66 72.71,36.83 66.04,36.83 7S2.8
N$55
  Bottom 0.152: RN4.6 84.14,22.54 77.79,22.54 74.93,25.4 74.93,28.26 72.39,30.8 72.39,31.75 71.12,33.02 7S2.5
N$56
  Bottom 0.152: 7S2.4 68.58,35.24 71.75,35.24 72.07,34.92 72.07,33.02 73.03,32.07 73.03,30.8 79.06,24.77 RN4.8
N$57
  Top 0.152: SR7S2.15 81.6,35.24 80.01,33.66 80.01,29.53 80.64,28.89 80.64,25.4 RN4.7
N$58
  Top 0.152: RN4.5 85.41,23.18 85.41,22.86 80.33,22.86 80.01,23.18 80.01,28.58 79.06,29.53 SR7S2.1
N$59
  Top 0.152: SR7S2.3 83.19,29.85 82.55,29.85 81.92,29.21 80.96,29.21 80.33,29.85 80.33,32.38 81.28,33.34 92.08,33.34 93.34,32.07 93.34,23.18 93.66,22.86 95.89,22.86 96.84,23.81 RN4.1
N$60
  Top 0.152: SR7S2.4 85.09,29.21 82.55,29.21 81.6,28.26 RN3.7
N$61
  Top 0.152: SR7S2.6 RN3.3
N$62
  Top 0.152: RN3.1 94.3,30.16 SR7S2.7
N$63
  Bottom 0.152: LED2.K 71.12,51.12 78.11,58.1 82.55,58.1 82.55,53.66 84.45,51.75 91.76,51.75 92.71,50.8 92.71,47.31 RN5.2
N$64
  Top 0.152: RN5.4 90.49,44.45 90.49,41.27 89.85,40.64 76.83,40.64 74.3,43.18 67.31,43.18 67.31,42.86 7S3.3
N$65
  Top 0.152: 7S3.2 65.09,43.18 65.09,47.62 65.6,48.13 69,48.13 69.19,47.94 69.22,47.94 69.85,47.31 69.85,45.09 70.8,44.13 82.55,44.13 RN5.6
N$66
  Bottom 0.152: RN5.8 75.88,48.89 70.48,48.89 69.53,47.94 69.53,45.09 67.94,45.09 67.31,45.72 67.31,47.94 66.04,49.21 61.28,49.21 60.64,48.58 60.64,46.35 7S3.10
N$67
  Top 0.152: 7S3.9 65.41,48.58 69.22,48.58 70.17,47.62 70.17,45.4 70.8,44.77 76.2,44.77 76.2,44.84 78.62,47.26 92.12,47.26 92.71,46.67 92.71,44.13 RN6.2
N$68
  Top 0.152: RN6.4 88.58,41.91 88.58,41.27 88.27,40.96 77.47,40.96 74.61,43.81 70.48,43.81 69.22,45.09 66.67,45.09 66.04,45.72 7S3.8
N$69
  Bottom 0.152: RN6.6 84.14,40 74.61,40 73.03,41.59 7S3.5
N$70
  Bottom 0.152: RN6.8 78.42,43.18 69.53,43.18 68.58,42.23 7S3.4
N$71
  Bottom 0.152: RN6.7 80.01,44.13 80.01,46.99 79.69,47.31 78.11,47.31 77.79,47.62 77.79,50.48 81.6,54.29 SR7S3.15
N$72
  Bottom 0.152: RN6.5 85.72,43.5 85.72,43.81 85.41,44.13 80.96,44.13 80.64,44.45 80.64,47.62 79.38,48.89 SR7S3.1
N$73
  Bottom 0.152: SR7S3.2 83.5,51.12 90.81,51.12 90.81,42.54 RN6.3
N$74
  Bottom 0.152: SR7S3.3 84.45,49.21 84.45,50.48 84.77,50.8 90.17,50.8 90.49,50.48 90.49,40.96 96.52,40.96 96.84,41.27 RN6.1
N$75
  Bottom 0.152: RN5.7 83.19,47.31 85.41,47.31 86.68,48.58 SR7S3.4
N$76
  Bottom 0.152: SR7S3.5 86.68,46.35 RN5.5
N$77
  Bottom 0.152: SR7S3.6 RN5.3
N$78
  Bottom 0.152: SR7S3.7 96.84,46.35 RN5.1
N$79
  Top 0.152: DBPASS.3 59.69,65.72 61.59,67.63 87.31,67.63 87.95,66.99 INPUTHEADER.P$3
N$80
  Top 0.152: SR7S2.2 81.6,32.7 90.17,32.7 90.49,32.38 90.49,24.77 RN4.3
N$81
  Top 0.152: SR7S2.5 86.68,28.26 RN3.5
N$82
  Bottom 0.152: DBPASS.1 5V.CP.1 54.61,73.34
N$83
  Bottom 0.152: 52.07,74.61 52.07,76.52 54.12,78.57 5V.CP.3
  Bottom 0.254: 52.07,74.61 51.75,74.61 50.8,73.66 50.8,68.58 51.75,67.63 51.75,60.01 GBPASS.1
N$84
  Top 0.152: 79.06,20.32 SR7S1.16 79.06,18.42 | 79.06,20.32 79.06,21.27 94.3,21.27 SR7S1.10 | DBPASS.2 61.91,58.74 | 61.91,58.74 61.91,54.93 62.07,54.77 | 62.07,54.77 62.23,54.61 67.31,54.61 | 67.31,54.61 77.47,54.61 79.06,56.2 SR7S3.16 | SR7S3.16 81.28,58.74 92.71,58.74 94.3,57.15 SR7S3.10 | 7S3.6 71.12,48.26 76.2,48.26 78.74,50.8 78.74,56.2 SR7S3.16 | SR7S1.10 95.89,17.15 98.74,17.15 98.74,35.24 94.3,35.24 SR7S2.10 92.71,40 80.01,40 79.06,39.05 SR7S2.16 78.74,38.73 7S2.6 | 56.83,32.7 56.83,26.35 57.78,25.4 60.64,25.4 7S1.1 61.28,25.72 61.28,14.92 73.98,2.22 93.34,2.22 93.34,11.75 90.17,14.92 85.09,14.92 82.87,17.15 82.87,20 81.92,20.96 79.69,20.96 79.06,20.32 | 56.83,32.7 57.78,33.66 7S2.1 | 7S3.1 56.83,37.46 | 56.83,37.46 56.83,32.7 | 56.83,54.29 56.83,54.61 61.91,54.61 62.07,54.77 | 56.83,54.29 56.83,37.46 | 94.61,18.73 SR7S1.10 | 61.91,58.74 62.87,58.74 OUTPUTHEADER.P$3 | T3.3 51.44,67.31 52.39,68.26 56.2,68.26 T1.3 | LED1.A 60.01,51.12 56.83,54.29 | LED2.A 68.26,53.66 67.31,54.61
  Bottom 0.152: SR7S1.16 77.79,17.46 70.8,17.46 69.85,18.42 69.85,26.35 71.12,27.62 7S1.6 | T1.3 56.83,63.82 DBPASS.2 57.63,63.02
N$85
  Top 0.152: SR7S3.9 96.84,59.37 79.69,59.37 79.06,58.74 78.11,58.74 74.93,55.56 69.22,55.56 67.94,56.83 67.94,58.42 70.48,60.96 OUTPUTHEADER.P$5
N$86
  Top 0.254: 4.93,60.64 ..VBUS 5.58,59.87 5.4,59.69 5.4,55.24 6.03,54.61 6.03,50.4 1A.1
N$87
  Top 0.254: ..D- 5.86,63.33 7.94,65.41 7.94,70.8 6.67,72.07 6.67,76.17 X1.D-
N$88
  Top 0.254: ..D+ 6.99,66.99 6.99,70.48 4.76,72.71 4.76,76.07 X1.D+
N$90  (via drill 3.2)
  other vias: 74.93,13.97
N$91  (via drill 3.2)
  other vias: 51.44,30.8
N$92  (via drill 3.2)  (1 unrouted)
  other vias: 75.31,51.64 45.4,63.18
N$93
  Bottom 0.152: T1.1 62.23,64.77 71.75,64.77 72.71,63.82 OUTPUTHEADER.P$7
N$94
  Top 0.152: RN10K.7 13.65,63.5 RN1K.8
  Bottom 0.152: U$5.P$1 RN1K.8
N$95
  Top 0.152: RN10K.2 12.38,76.2 | 12.38,76.2 11.43,75.25 11.43,71.12 | 11.43,71.12 11.43,66.04 | 11.43,66.04 11.43,62.23 RN10K.8 | RN10K.4 11.43,71.12 | RN10K.6 11.43,66.04 | INPUTBOARD1.1 21.91,64.77 23.18,66.04 23.18,79.38 18.1,79.38 17.46,80.01 12.38,80.01 11.43,79.06 11.43,77.15 12.38,76.2
N$96
  Top 0.152: INPUTBOARD1.3 20.64,69.85 19.05,68.26 19.05,66.36 RN1K.7
N$97
  Top 0.152: INPUTBOARD1.4 20,72.39 RN1K.5
N$98
  Top 0.152: INPUTBOARD1.5 17.46,74.93 RN1K.3
N$99
  Top 0.152: INPUTBOARD1.6 17.46,77.47 RN1K.1
N$100
  Top 0.152: U$4.P$2 22.23,52.39 | U$4.P$2 22.23,53.98 U$5.P$2 18.73,64.77 INPUTBOARD1.2 | U$2.P$2 12.7,50.16 U$3.P$2 16.51,46.67 19.05,49.21 20,49.21 U$4.P$2
N$101
  Top 0.152: RN10K.5 13.65,68.58 RN1K.6
  Bottom 0.152: RN1K.6 17.14,65.09 17.46,65.09 17.46,64.45 17.78,64.14 17.78,53.34 U$4.P$1
N$102
  Top 0.152: RN10K.3 13.65,73.66 RN1K.4
  Bottom 0.152: RN1K.4 18.41,71.12 19.37,70.17 19.37,63.82 18.73,63.18 18.73,59.05 20.32,57.47 20.32,52.7 20.95,52.07 20.95,48.89 U$3.P$1
N$103
  Top 0.152: RN10K.1 13.65,78.74 RN1K.2
  Bottom 0.152: RN1K.2 14.92,76.2 14.61,75.88 14.61,52.07 U$2.P$1
N$104
  Top 0.152: 91.92,56.36 92.08,56.52 92.08,56.83 94.93,53.98 98.42,53.98 98.42,63.5 93.03,63.5 INPUTHEADER.P$7 92.71,63.5 | 91.92,56.36 91.76,56.2 | SR7S3.11 91.92,56.36
  Bottom 0.152: 91.12,57.15 SR7S3.11 91.76,54.93 91.44,54.61 87.95,54.61 87.63,54.93 87.63,57.47 87,58.1 86.04,58.1 85.72,57.78 85.72,54.29 86.04,53.98 91.76,53.98 92.08,53.66 92.08,53.02 95.25,49.85 95.25,48.58 96.52,47.31 97.47,47.31 98.42,46.35 98.42,40.64 98.11,40.32 93.66,40.32 SR7S2.11 | SR7S1.11 91.44,18.42 91.44,17.15 88.27,17.15 87.63,17.78 87.63,19.69 87,20.32 86.04,20.32 85.72,20 85.72,17.46 87.31,15.88 95.89,15.88 95.89,10.16 96.52,9.53 98.42,9.53 99.06,8.89 99.06,1.27 70.17,1.27 57.47,13.97 57.47,51.75 59.21,53.5 | 59.21,53.5 59.37,53.66 72.07,53.66 78.42,60.01 | 78.42,60.01 87.63,60.01 89.41,61.45 90.66,61.45 INPUTHEADER.P$7 | 78.42,60.01 76.83,60.01 | T1.2 58.1,64.77 58.42,64.45 58.42,58.1 58.74,57.78 58.74,53.98 59.21,53.5
N$107
  Bottom 0.152: T3.1 53.02,70.8 52.7,71.12 52.39,71.12 52.07,71.44 52.07,73.34 52.7,73.98 59.37,73.98 65.09,68.26 66.99,68.26 67.94,67.31 67.94,65.72 68.26,65.41 70.8,65.41 OUTPUTHEADER.P$6
N$1005  (via drill 3.2)  (2 unrouted)
  other vias: 45.4,48.89 21.27,60.64 7.94,56.83
VCC
  Top 0.254: INPUTBOARD.2 4.45,26.04 4.45,35.88 3.49,36.83 3.49,40 3.81,40.32 6.67,40.32 6.67,39.05 DISPLAY.6 | GPIOHEADER.17 13.02,5.71 13.97,4.96 16.83,4.96 16.83,24.77 R1.2
  Bottom 0.152: GPIOHEADER.1 32.38,6.98 32.38,16.19 32.2,16.38 32.2,16.64 32.07,16.77 23.32,16.77 22.54,17.61 22.54,18.1 22.23,18.42 22.23,20 20,20 20,23.18 20.95,24.13 THERMHEADER.P$1
  Bottom 0.254: INPUTBOARD.2 14.29,24.13 R1.2 19.68,25.72 THERMHEADER.P$1

### Text on the board
tPlace: I4 | I3 | I2 | I1 | GND | VCC | 1,GND 2,VCC | I1 | I2 | I4 | I3 | VCC | GND | I1 | I2 | I3 | I4
tNames: (c) PiCH 2013 | (c) 2013 | PiCH | (c) PiCH 2013 | (c) PiCH 2013 | (c) PiCH 2013 | PiCH v1.0.3 / http://davegreen.github.io/PiCH/ / (c) PiCH 2013